# EAGLE design RF-Shield (EAGLE 8.4.1)
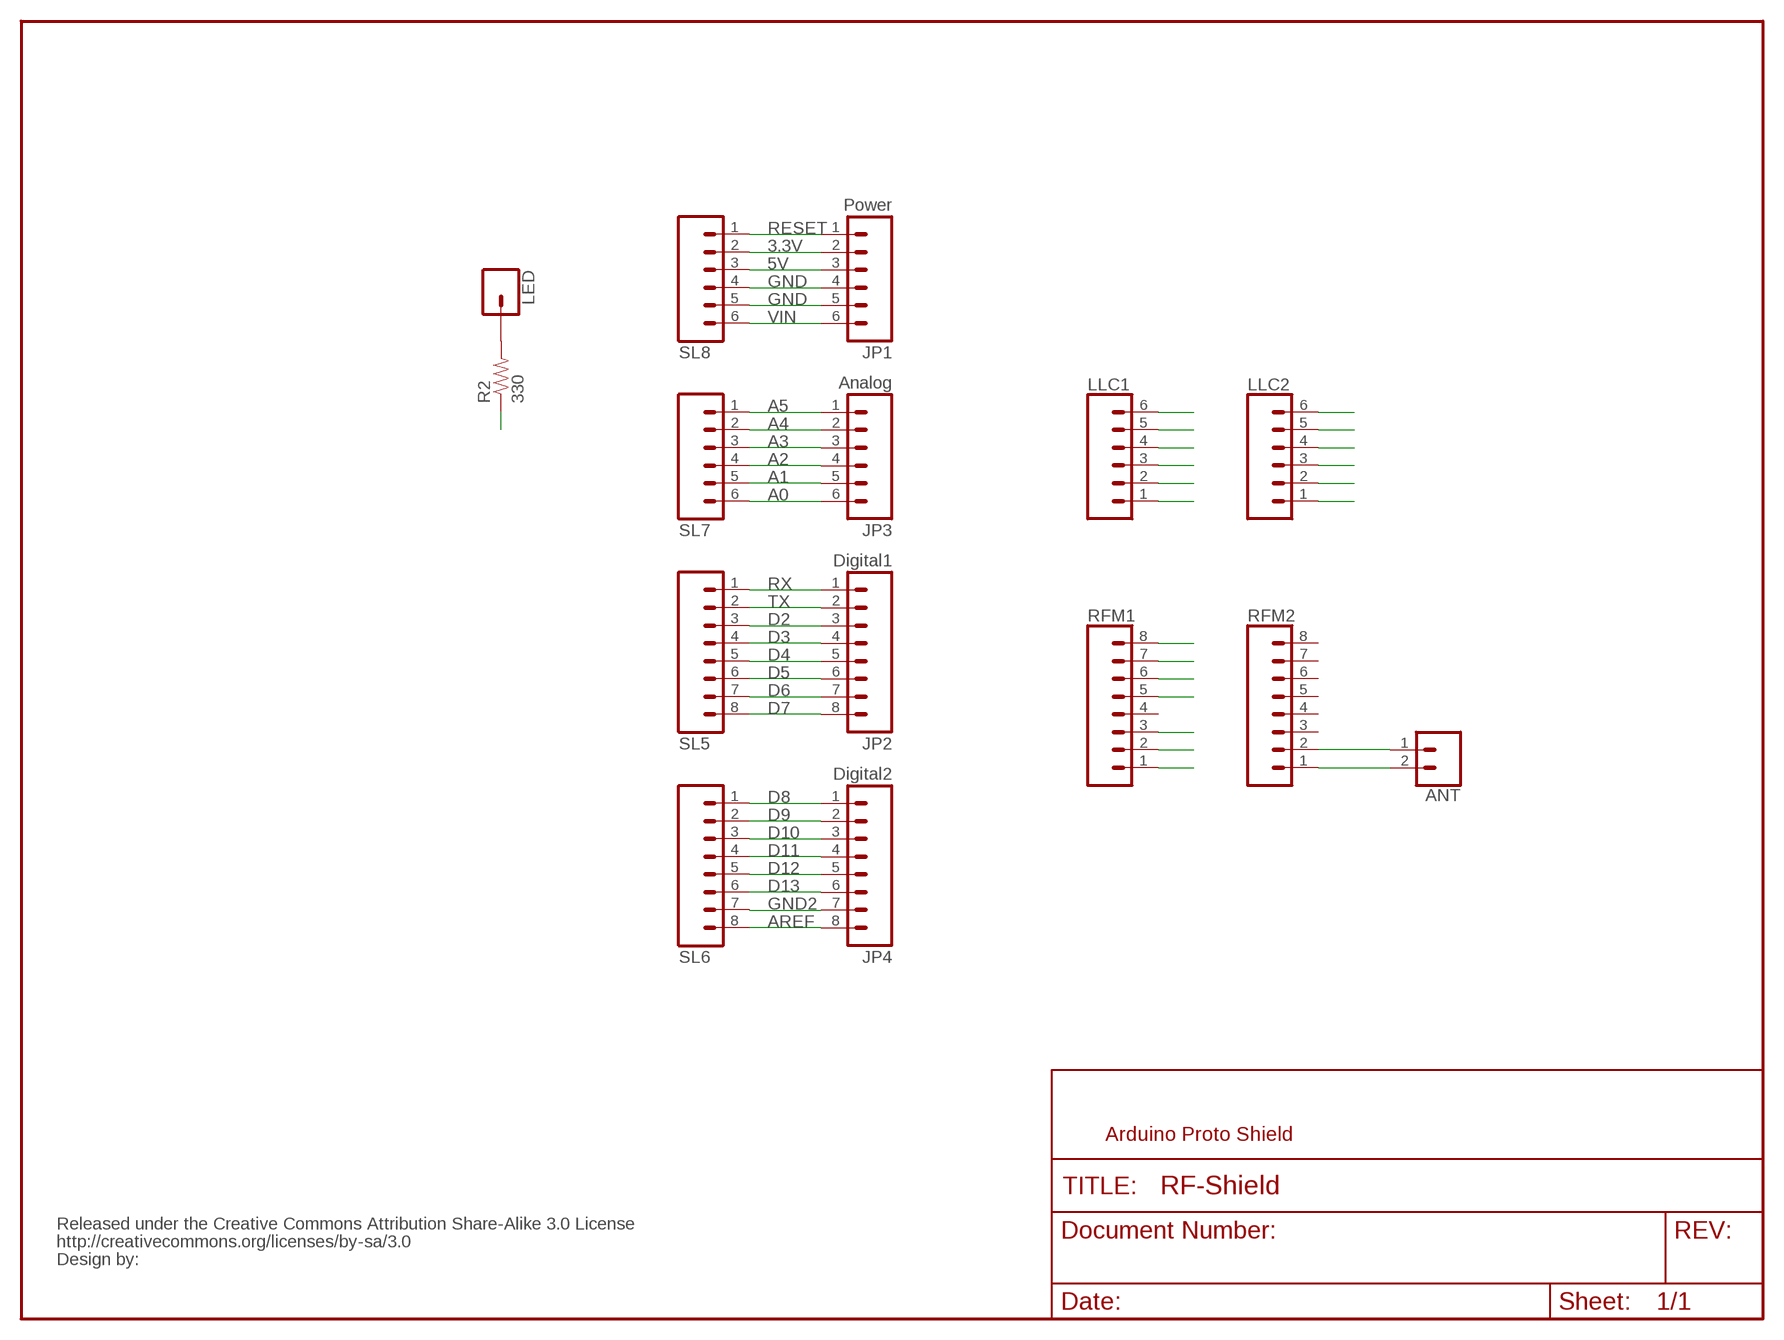
[diagram p0: schematic, sheet 1]

## Parts
ANT  CONN_021X02_NO_SILK  [1X02_NO_SILK]
JP1  Power  M06SIP  [1X06]
JP2  Digital1  M08  [1X08]
JP3  Analog  M06SIP  [1X06]
JP4  Digital2  M08  [1X08]
LED  CONN_01PTH_NO_SILK_YES_STOP  [1X01_NO_SILK]
LLC1  CONN_06NO_SILK_NO_POP  [1X06_NO_SILK]
LLC2  CONN_06NO_SILK_NO_POP  [1X06_NO_SILK]
R2  330  RESISTORPTH1  [AXIAL-0.3]
RFM1  CONN_08NO_SILK_FEMALE_PTH  [1X08_NO_SILK]
RFM2  CONN_08NO_SILK_FEMALE_PTH  [1X08_NO_SILK]
SL5  M08  [1X08]
SL6  M08  [1X08]
SL7  M06SIP  [1X06]
SL8  M06SIP  [1X06]
U$2  CREATIVE_COMMONS  [CREATIVE_COMMONS]

## Nets
3.3V: JP1.2 LLC2.3 RFM1.1 SL8.2
5V [power]: JP1.3 LLC1.3 SL8.3
A0: JP3.6 SL7.6
A1: JP3.5 SL7.5
A2: JP3.4 SL7.4
A3: JP3.3 SL7.3
A4: JP3.2 SL7.2
A5: JP3.1 SL7.1
ANT: ANT.1 RFM2.2
AREF: JP4.8 SL6.8
C: LLC2.2 RFM1.6
D2: JP2.3 RFM1.3 SL5.3
D3: JP2.4 SL5.4
D4: JP2.5 SL5.5
D5: JP2.6 SL5.6
D6: JP2.7 SL5.7
D7: JP2.8 SL5.8
D8: JP4.1 SL6.1
D9: JP4.2 SL6.2
D10: JP4.3 LLC1.1 SL6.3
D11: JP4.4 LLC1.5 SL6.4
D12: JP4.5 LLC1.6 SL6.5
D13: JP4.6 LLC1.2 SL6.6
GND [power]: JP1.4 JP1.5 LLC1.4 LLC2.4 RFM1.2 SL8.4 SL8.5
GND2 [power]: JP4.7 R2.P$1 SL6.7
GND3: ANT.2 RFM2.1
I: LLC2.5 RFM1.7
N$1: LED.1 R2.P$2
O: LLC2.6 RFM1.8
RESET: JP1.1 SL8.1
RX: JP2.1 SL5.1
S: LLC2.1 RFM1.5
TX: JP2.2 SL5.2
VIN [power]: JP1.6 SL8.6
Unconnected: RFM1.4 RFM2.3 RFM2.4 RFM2.5 RFM2.6 RFM2.7 RFM2.8

## Notes on the sheet
- Arduino Proto Shield

## Library data of the parts
ANT = SparkFun-Connectors:CONN_02: Multi connection point. Often used as Generic Header-pin footprint for 0.1 inch spaced/style header connections On any of the 0.1 inch spaced packages, you can populate with these: Break Away Headers - Straight <https://www.sparkfun.com/products/116> (PRT-00116) Break Away Male Headers - Right Angle <https://www.sparkfun.com/products/553> (PRT-00553) Female Headers <https://www.sparkfun.com/products/115> (PRT-00115) Break Away Headers - Machine Pin <https://www.sparkfun.com/products/117> (PRT-00117) Break Away Female Headers - Swiss Machine Pin <https://www.sparkfun.com/products/743> (PRT-00743) For SCREWTERMINALS and SPRING TERMINALS visit here: Screw Terimnals on SparkFun.com <https://www.sparkfun.com/search/results?term=Screw+Terminals> (5mm/3.5mm/2.54mm spacing) This device is also useful as a general connection point to wire up your design to another part of your project. Our various solder wires solder well into these plated through hole pads. Hook-Up Wire - Assortment (Stranded, 22 AWG) <https://www.sparkfun.com/products/11375> (PRT-11375) Hook-Up Wire - Assortment (Solid Core, 22 AWG) <https://www.sparkfun.com/products/11367> (PRT-11367) View the entire wire category on our website here <https://www.sparkfun.com/categories/141> Special notes: Molex polarized connector foot print use with: PRT-08233 with associated crimp pins and housings. 2.54_SCREWTERM for use with PRT-10571. 3.5mm Screw Terminal footprints for PRT-08084 5mm Screw Terminal footprints for use with PRT-08432
JP1 JP3 SL7 SL8 = SparkFun:M06: Header 6 Standard 6-pin 0.1" header. Use with straight break away headers (SKU : PRT-00116), right angle break away headers (PRT-00553), swiss pins (PRT-00743), machine pins (PRT-00117), and female headers (PRT-00115). Molex polarized connector foot print use with SKU : PRT-08094 with associated crimp pins and housings. NOTES ON THE VARIANTS LOCK and LOCK_LONGPADS... This footprint was designed to help hold the alignment of a through-hole component (i.e. 6-pin header) while soldering it into place. You may notice that each hole has been shifted either up or down by 0.005 of an inch from it's more standard position (which is a perfectly straight line). This slight alteration caused the pins (the squares in the middle) to touch the edges of the holes. Because they are alternating, it causes a "brace" to hold the component in place. 0.005 has proven to be the perfect amount of "off-center" position when using our standard breakaway headers. Although looks a little odd when you look at the bare footprint, once you have a header in there, the alteration is very hard to notice. Also, if you push a header all the way into place, it is covered up entirely on the bottom side. This idea of altering the position of holes to aid alignment will be further integrated into the Sparkfun Library for other footprints. It can help hold any component with 3 or more connection pins.
JP2 JP4 SL5 SL6 = SparkFun:M08: Header 8 Standard 8-pin 0.1" header. Use with straight break away headers (SKU : PRT-00116), right angle break away headers (PRT-00553), swiss pins (PRT-00743), machine pins (PRT-00117), and female headers (PRT-00115).
LED = SparkFun-Connectors:CONN_01: Single connection point. Often used as Generic Header-pin footprint for 0.1 inch spaced/style header connections On any of the 0.1 inch spaced packages, you can populate with these: Break Away Headers - Straight <https://www.sparkfun.com/products/116> (PRT-00116) Break Away Male Headers - Right Angle <https://www.sparkfun.com/products/553> (PRT-00553) Female Headers <https://www.sparkfun.com/products/115> (PRT-00115) Break Away Headers - Machine Pin <https://www.sparkfun.com/products/117> (PRT-00117) Break Away Female Headers - Swiss Machine Pin <https://www.sparkfun.com/products/743> (PRT-00743) This device is also useful as a general connection point to wire up your design to another part of your project. Our various solder wires solder well into these plated through hole pads. Hook-Up Wire - Assortment (Stranded, 22 AWG) <https://www.sparkfun.com/products/11375> (PRT-11375) Hook-Up Wire - Assortment (Solid Core, 22 AWG) <https://www.sparkfun.com/products/11367> (PRT-11367) View the entire wire category on our website here <https://www.sparkfun.com/categories/141> Special notes: SMTSO-256-ET is a "flush mount" nut for a 4-40 screw. We mostly use this on specialty testbeds; it is a nice way to connect hardware to your PCB at an adjustable hieght. Also note, the SNAP packages are for using a snappable style connector. We sell a baggie of snaps and they are also used on two LilyPad designs: Snap Assortment - 30 pack (male and female) <https://www.sparkfun.com/products/11347> (DEV-11347) LilyPad Arduino SimpleSnap <https://www.sparkfun.com/products/10941> (DEV-10941) LilyPad SimpleSnap Protoboard <https://www.sparkfun.com/products/10940> (DEV-10940)
LLC1 LLC2 = SparkFun-Connectors:CONN_06: Multi connection point. Often used as Generic Header-pin footprint for 0.1 inch spaced/style header connections On any of the 0.1 inch spaced packages, you can populate with these: Break Away Headers - Straight <https://www.sparkfun.com/products/116> (PRT-00116) Break Away Male Headers - Right Angle <https://www.sparkfun.com/products/553> (PRT-00553) Female Headers <https://www.sparkfun.com/products/115> (PRT-00115) Break Away Headers - Machine Pin <https://www.sparkfun.com/products/117> (PRT-00117) Break Away Female Headers - Swiss Machine Pin <https://www.sparkfun.com/products/743> (PRT-00743) Arduino Stackable Header - 6 Pin <https://www.sparkfun.com/products/9280> (PRT-09280) For SCREWTERMINALS and SPRING TERMINALS visit here: Screw Terimnals on SparkFun.com <https://www.sparkfun.com/search/results?term=Screw+Terminals> (5mm/3.5mm/2.54mm spacing) This device is also useful as a general connection point to wire up your design to another part of your project. Our various solder wires solder well into these plated through hole pads. Hook-Up Wire - Assortment (Stranded, 22 AWG) <https://www.sparkfun.com/products/11375> (PRT-11375) Hook-Up Wire - Assortment (Solid Core, 22 AWG) <https://www.sparkfun.com/products/11367> (PRT-11367) View the entire wire category on our website here <https://www.sparkfun.com/categories/141>
R2 = SparkFun:RESISTOR: Resistor Basic schematic elements and footprints for 0603, 1206, and PTH 1/10th watt (small) resistors.
RFM1 RFM2 = SparkFun-Connectors:CONN_08: Multi connection point. Often used as Generic Header-pin footprint for 0.1 inch spaced/style header connections On any of the 0.1 inch spaced packages, you can populate with these: Break Away Headers - Straight <https://www.sparkfun.com/products/116> (PRT-00116) Break Away Male Headers - Right Angle <https://www.sparkfun.com/products/553> (PRT-00553) Female Headers <https://www.sparkfun.com/products/115> (PRT-00115) Break Away Headers - Machine Pin <https://www.sparkfun.com/products/117> (PRT-00117) Break Away Female Headers - Swiss Machine Pin <https://www.sparkfun.com/products/743> (PRT-00743) Arduino Stackable Header - 8 Pin <https://www.sparkfun.com/products/9279> (PRT-09279) For SCREWTERMINALS and SPRING TERMINALS visit here: Screw Terimnals on SparkFun.com <https://www.sparkfun.com/search/results?term=Screw+Terminals> (5mm/3.5mm/2.54mm spacing) This device is also useful as a general connection point to wire up your design to another part of your project. Our various solder wires solder well into these plated through hole pads. Hook-Up Wire - Assortment (Stranded, 22 AWG) <https://www.sparkfun.com/products/11375> (PRT-11375) Hook-Up Wire - Assortment (Solid Core, 22 AWG) <https://www.sparkfun.com/products/11367> (PRT-11367) View the entire wire category on our website here <https://www.sparkfun.com/categories/141> Special notes: Molex polarized connector foot print use with SKU : PRT-08231 with associated crimp pins and housings. 1MM SMD Version SKU: PRT-10208 NOTES ON THE VARIANTS LOCK and LOCK_LONGPADS... This footprint was designed to help hold the alignment of a through-hole component (i.e. 6-pin header) while soldering it into place. You may notice that each hole has been shifted either up or down by 0.005 of an inch from it's more standard position (which is a perfectly straight line). This slight alteration caused the pins (the squares in the middle) to touch the edges of the holes. Because they are alternating, it causes a "brace" to hold the component in place. 0.005 has proven to be the perfect amount of "off-center" position when using our standard breakaway headers. Although looks a little odd when you look at the bare footprint, once you have a header in there, the alteration is very hard to notice. Also,if you push a header all the way into place, it is covered up entirely on the bottom side.; PROD_ID: CONN-08438
U$2 = SparkFun:CREATIVE_COMMONS

## Net classes
1 power: width 0.254 mm

## Board
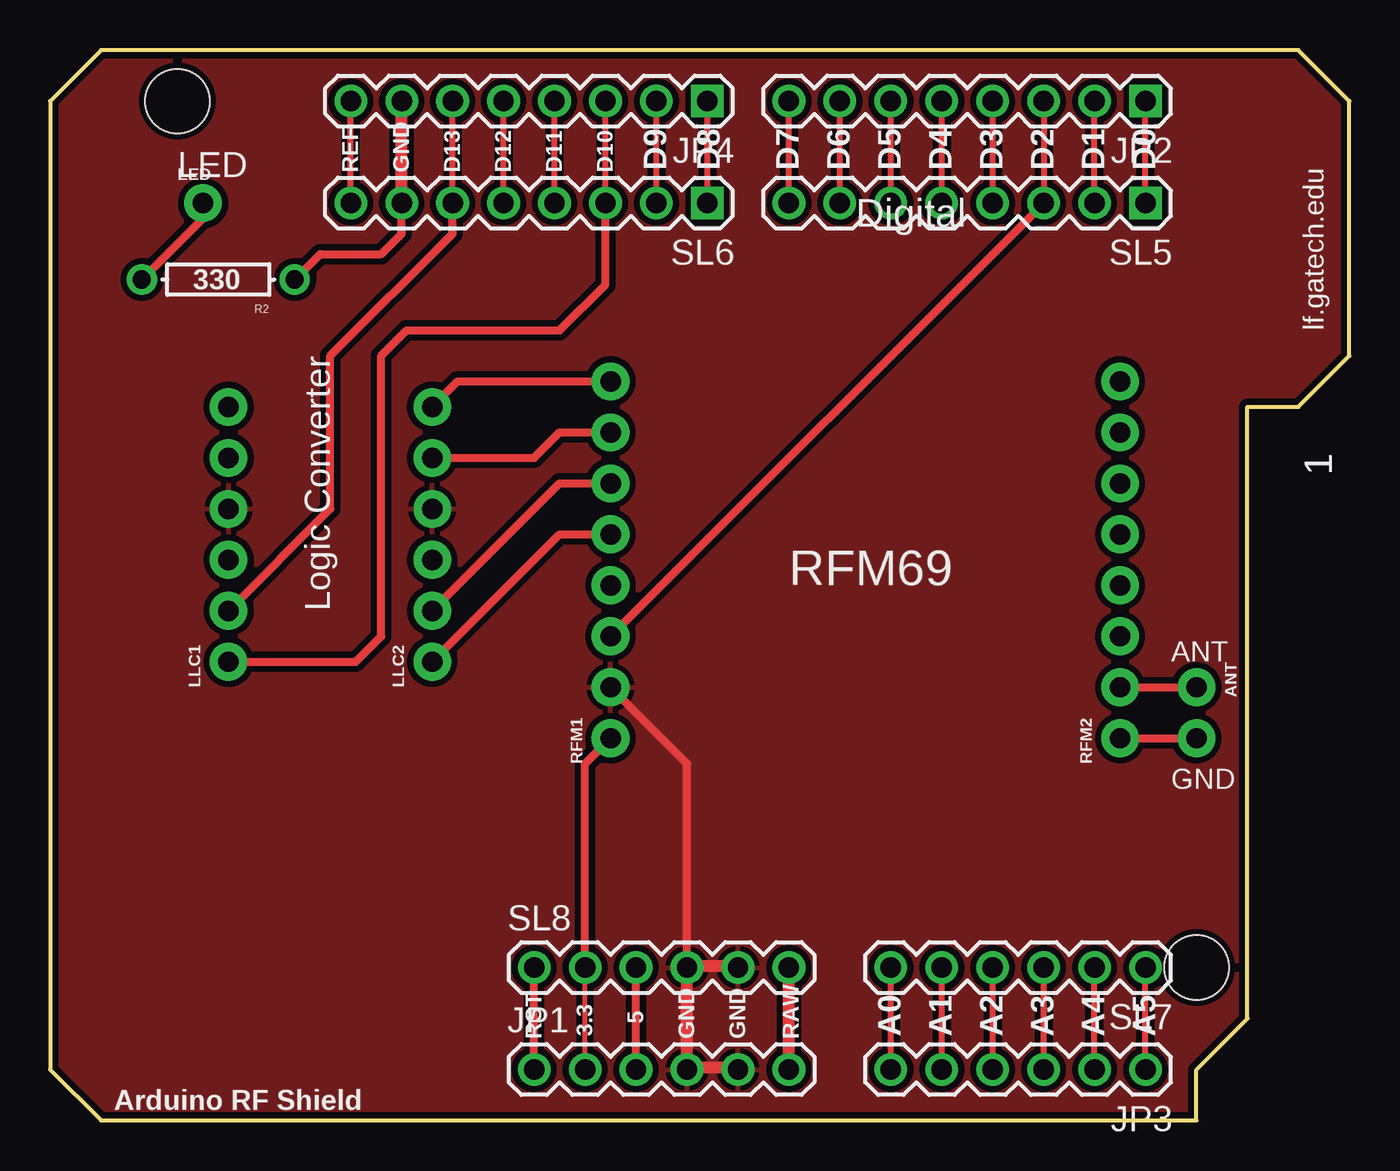
[diagram p1: board, top side]
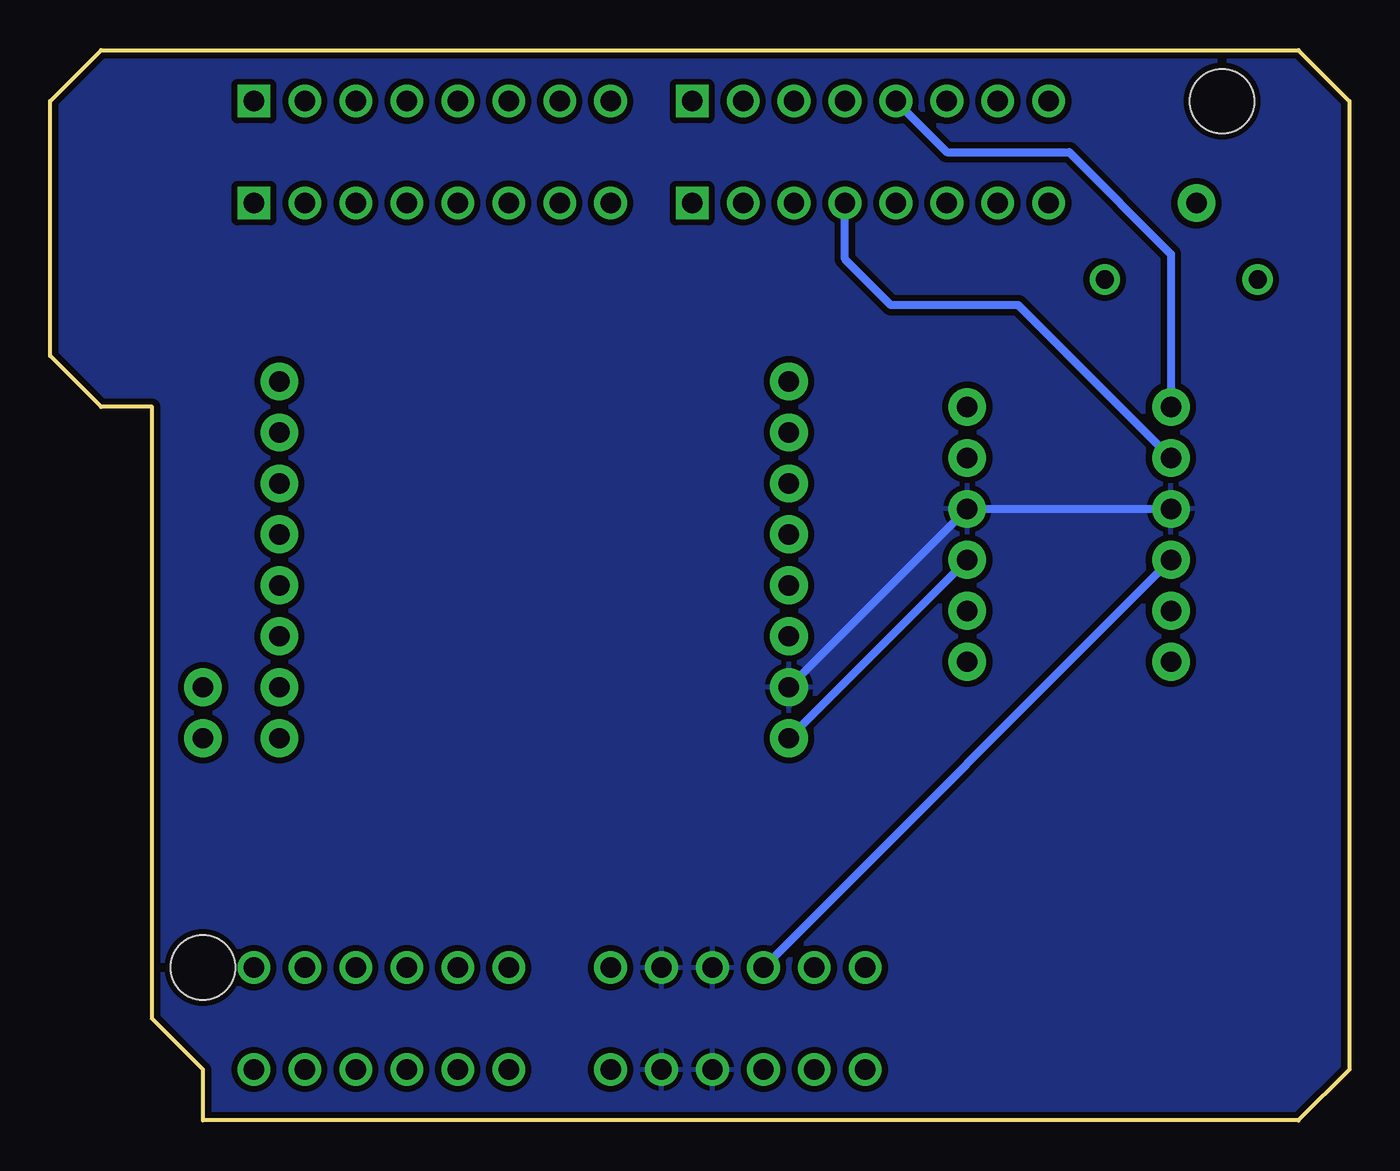
[diagram p2: board, bottom side, seen from below]

Size 64.77 x 53.34 mm. Coordinates in mm from the lower left corner, seen from the top.
Outline: 0,50.8 0,2.54 2.54,0 57.15,0 57.15,2.54 59.69,5.08 59.69,35.56 62.23,35.56 64.77,38.1 64.77,50.8 62.23,53.34 2.54,53.34 0,50.8
Copper layers (1*16): Top 0.035mm / dielectric 1.5mm / Bottom 0.035mm
Design rules "SparkFun": minimum track width 8mil, minimum drill 20mil, track to track 8mil, track to pad 8mil, pad to pad 8mil, via to via 8mil, smd to smd 8mil, copper to edge 10mil, drill to drill 8mil, minimum pad ring 12mil, minimum via ring 10mil, stop-mask expansion 4mil, vias tented up to drill 20mil, thermal gap 10mil
Holes 3.2 mm at 57.15,7.62 6.35,50.8

### Footprints (pad centres in the part's own frame; a part is rotated, then mirrored left to right if it is on the bottom)
1X02_NO_SILK = drill 1.016 pad 1.88: 1 0,0; 2 2.54,0
1X06 = drill 1.016: 1 0,0; 2 2.54,0; 3 5.08,0; 4 7.62,0; 5 10.16,0; 6 12.7,0
1X08 = drill 1.016 square: 1 0,0 | drill 1.016: 2 2.54,0; 3 5.08,0; 4 7.62,0; 5 10.16,0; 6 12.7,0; 7 15.24,0; 8 17.78,0
1X01_NO_SILK = drill 1.016 pad 1.88: 1 0,0
1X06_NO_SILK = drill 1.016 pad 1.88: 1 0,0; 2 2.54,0; 3 5.08,0; 4 7.62,0; 5 10.16,0; 6 12.7,0
AXIAL-0.3 = drill 0.9: P$1 -3.81,0; P$2 3.81,0
1X08_NO_SILK = drill 1.016 pad 1.88: 1 0,0; 2 2.54,0; 3 5.08,0; 4 7.62,0; 5 10.16,0; 6 12.7,0; 7 15.24,0; 8 17.78,0

### Placement (x,y rotation side)
ANT  57.15,21.59 270 top
JP1  24.13,2.54 0 top
JP2  54.61,50.8 180 top
JP3  54.61,2.54 180 top
JP4  32.77,50.8 180 top
LED  7.62,45.72 0 top
LLC1  8.89,22.86 90 top
LLC2  19.05,22.86 90 top
R2  8.38,41.91 180 top
RFM1  27.94,19.05 90 top
RFM2  53.34,19.05 90 top
SL5  54.61,45.72 180 top
SL6  32.77,45.72 180 top
SL7  54.61,7.62 180 top
SL8  24.13,7.62 0 top
U$2  0,-12.7 0 top  (outside the outline)

### Tracks (layer width: path | path; a pad name or v marks a point on that pad's centre or on a via)
3.3V
  Top 0.254: JP1.2 SL8.2
  Top 0.406: SL8.2 26.67,17.78 RFM1.1
  Bottom 0.406: RFM1.1 LLC2.3
5V
  Top 0.406: JP1.3 SL8.3
  Bottom 0.406: SL8.3 LLC1.3
A0
  Top 0.305: JP3.6 SL7.6
A1
  Top 0.305: JP3.5 SL7.5
A2
  Top 0.305: JP3.4 SL7.4
A3
  Top 0.305: JP3.3 SL7.3
A4
  Top 0.305: JP3.2 SL7.2
A5
  Top 0.305: JP3.1 SL7.1
ANT
  Top 0.406: RFM2.2 ANT.1
AREF
  Top 0.305: SL6.8 JP4.8
C
  Top 0.406: LLC2.2 25.4,31.75 RFM1.6
D2
  Top 0.305: JP2.3 SL5.3
  Top 0.406: SL5.3 RFM1.3
D3
  Top 0.305: SL5.4 JP2.4
D4
  Top 0.305: SL5.5 JP2.5
D5
  Top 0.305: SL5.6 JP2.6
D6
  Top 0.305: SL5.7 JP2.7
D7
  Top 0.305: SL5.8 JP2.8
D8
  Top 0.305: SL6.1 JP4.1
D9
  Top 0.305: SL6.2 JP4.2
D10
  Top 0.305: SL6.3 JP4.3
  Top 0.406: LLC1.1 15.24,22.86 16.51,24.13 16.51,38.1 17.78,39.37 25.4,39.37 27.69,41.66 SL6.3
D11
  Top 0.305: SL6.4 JP4.4
  Bottom 0.406: LLC1.5 16.51,40.64 22.86,40.64 25.15,42.93 SL6.4
D12
  Top 0.305: SL6.5 JP4.5
  Bottom 0.406: JP4.5 20.07,48.26 13.97,48.26 8.89,43.18 LLC1.6
D13
  Top 0.305: SL6.6 JP4.6
  Top 0.406: LLC1.2 13.97,30.48 13.97,38.1 20.07,44.2 SL6.6
GND
  Top 0.406: SL8.4 31.75,17.78 RFM1.2
  Top 0.61: JP1.5 33.58,2.64 32.36,2.64 JP1.4 SL8.4 32.36,7.72 33.58,7.72 SL8.5
  Bottom 0.406: LLC1.4 LLC2.4 RFM1.2
  pour Bottom (isolate 0.305): 64.77,53.34 64.77,0 0,0 0,53.34
  pour Top (isolate 0.305): 64.77,53.34 64.77,0 0,0 0,53.34
GND2
  Top 0.406: R2.P$1 13.46,43.18 16.51,43.18 17.53,44.2 SL6.7
  Top 0.61: SL6.7 JP4.7
GND3
  Top 0.406: RFM2.1 ANT.2
I
  Top 0.406: LLC2.5 24.13,33.02 25.4,34.29 RFM1.7
N$1
  Top 0.406: R2.P$2 7.62,44.96 LED.1
O
  Top 0.406: LLC2.6 20.32,36.83 RFM1.8
RESET
  Top 0.406: JP1.1 SL8.1
RX
  Top 0.305: SL5.1 JP2.1
S
  Top 0.406: LLC2.1 25.4,29.21 RFM1.5
TX
  Top 0.305: SL5.2 JP2.2
VIN
  Top 0.61: JP1.6 SL8.6

### Text on the board
tPlace: LED | REF | GND | D13 | D12 | D11 | D10 | D9 | D8 | D7 | D6 | D5 | D4 | D3 | D2 | D1 | D0 | lf.gatech.edu | Logic Converter | RFM69 | ANT | GND | 5 | RST | 3.3 | GND | GND | RAW | A0 | A1 | A2 | A3 | A4 | A5 | Arduino RF Shield
tNames: Digital | 1